# Altium schematic sheet NTC.SchDoc: NTC
size A3; Date: 13/11/2025; DrawnBy: Văn Quý Tuân; Revision: 1; SheetNumber: 6; SheetTotal: 10; Subsystem: HW-11/11/25; Size: A3
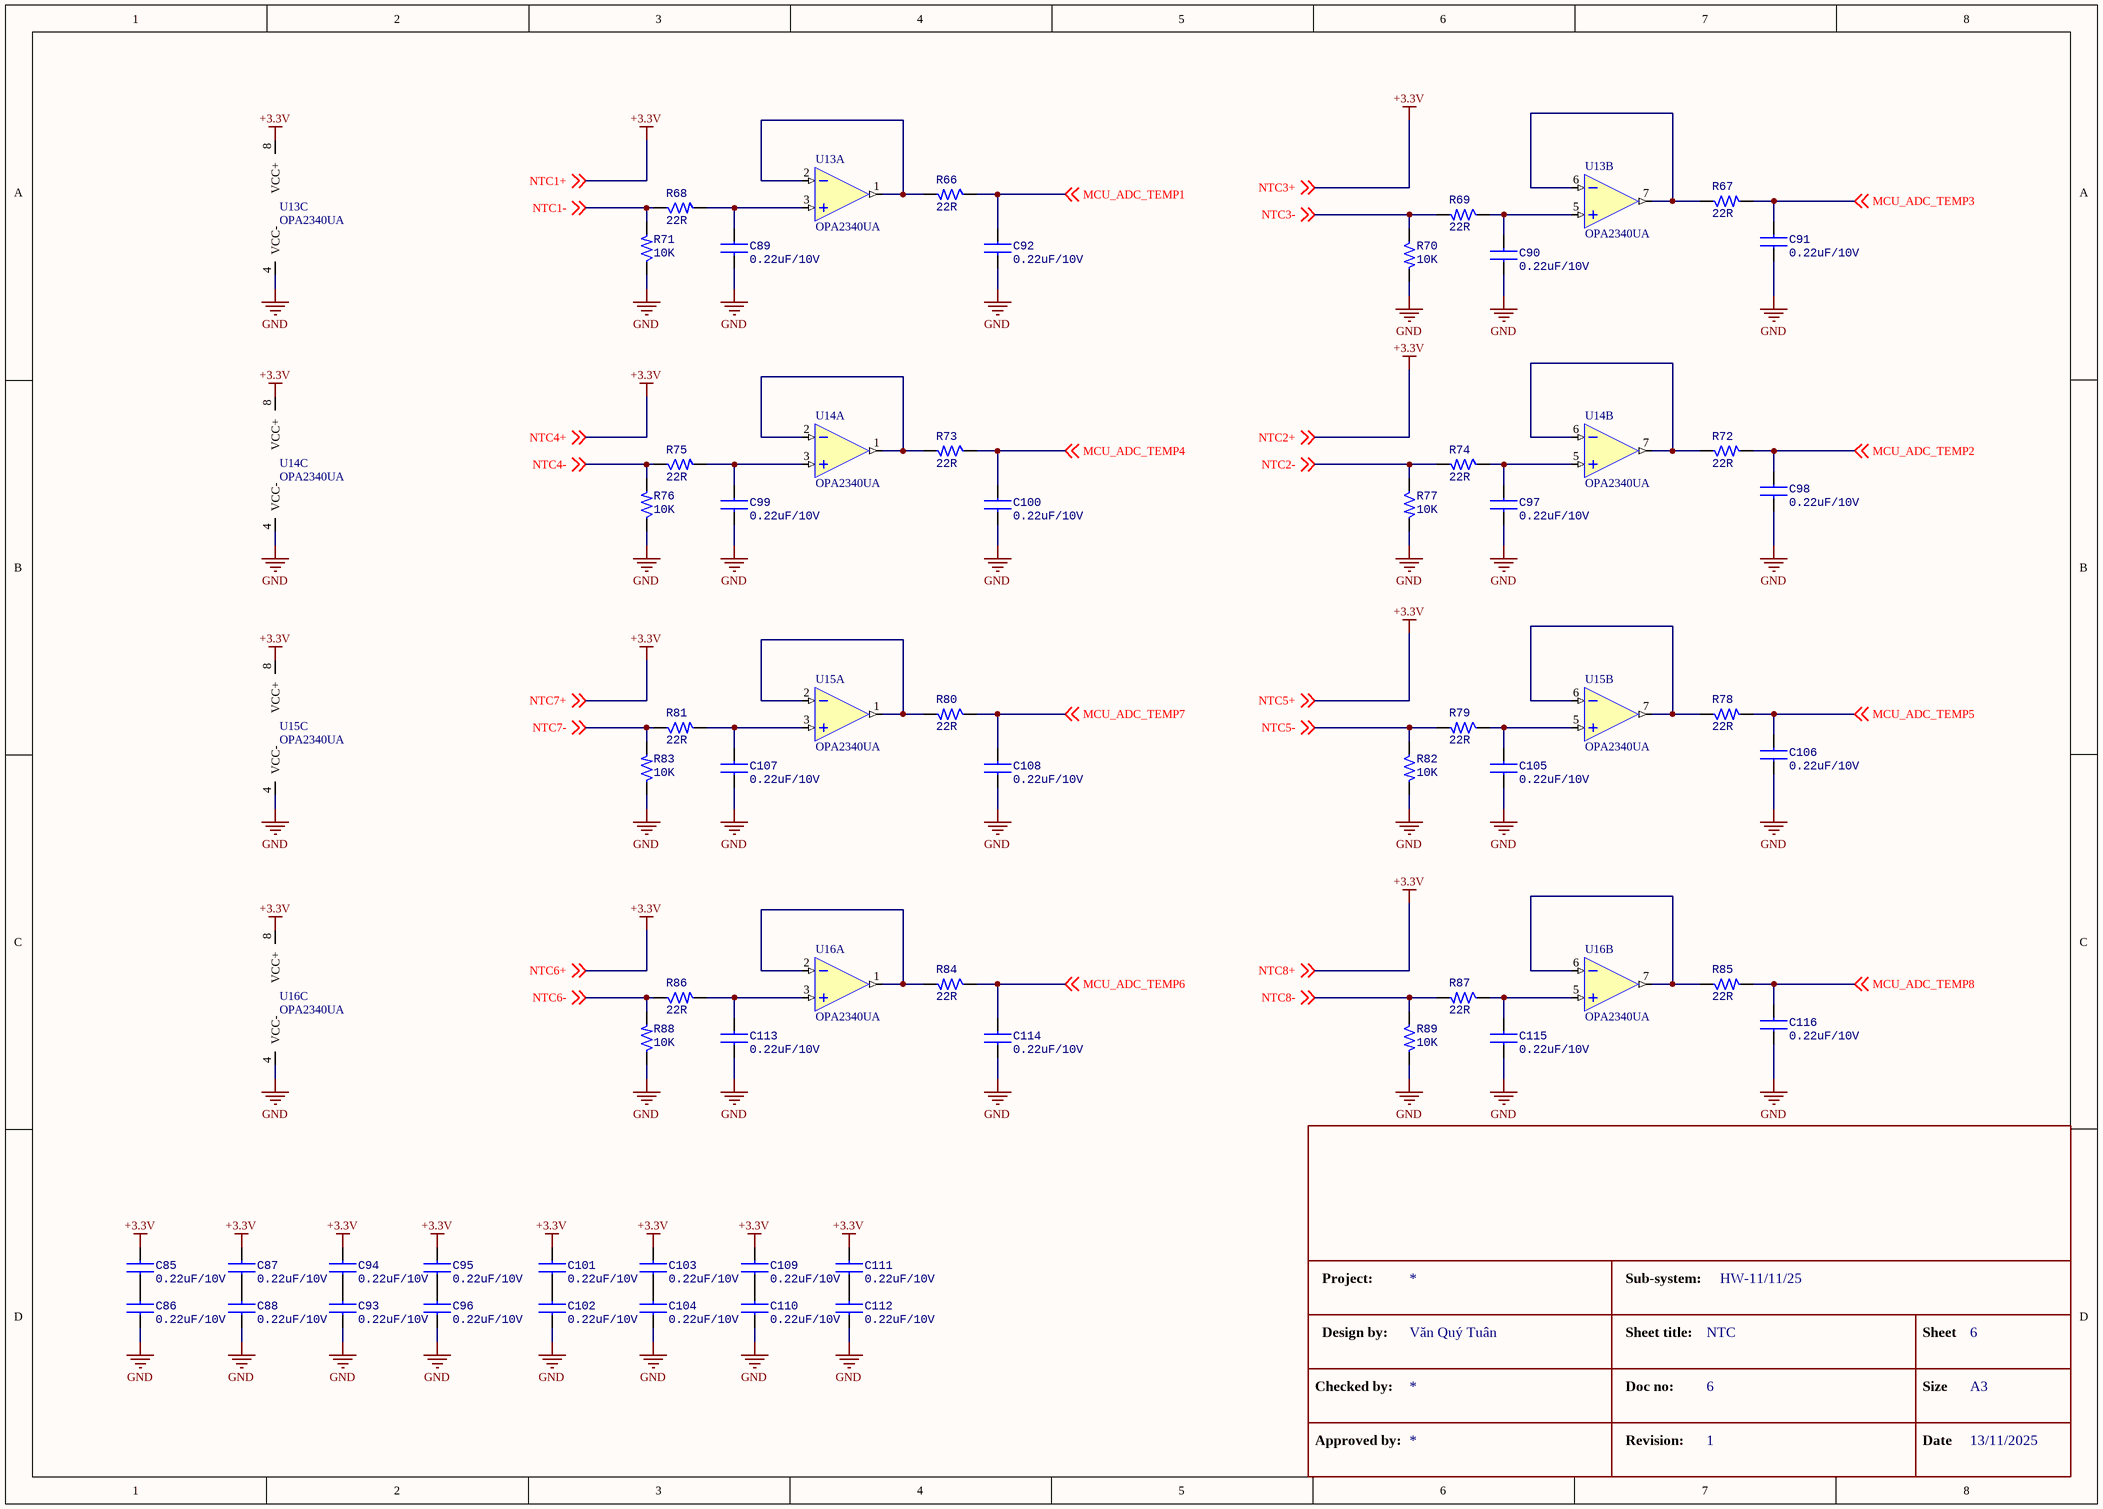
[diagram p0: NTC.SchDoc]

## Parts
C85  0.22uF/10V  [CAP-CER-0603]
C86  0.22uF/10V  [CAP-CER-0603]
C87  0.22uF/10V  [CAP-CER-0603]
C88  0.22uF/10V  [CAP-CER-0603]
C89  0.22uF/10V  [CAP-CER-0603]
C90  0.22uF/10V  [CAP-CER-0603]
C91  0.22uF/10V  [CAP-CER-0603]
C92  0.22uF/10V  [CAP-CER-0603]
C93  0.22uF/10V  [CAP-CER-0603]
C94  0.22uF/10V  [CAP-CER-0603]
C95  0.22uF/10V  [CAP-CER-0603]
C96  0.22uF/10V  [CAP-CER-0603]
C97  0.22uF/10V  [CAP-CER-0603]
C98  0.22uF/10V  [CAP-CER-0603]
C99  0.22uF/10V  [CAP-CER-0603]
C100  0.22uF/10V  [CAP-CER-0603]
C101  0.22uF/10V  [CAP-CER-0603]
C102  0.22uF/10V  [CAP-CER-0603]
C103  0.22uF/10V  [CAP-CER-0603]
C104  0.22uF/10V  [CAP-CER-0603]
C105  0.22uF/10V  [CAP-CER-0603]
C106  0.22uF/10V  [CAP-CER-0603]
C107  0.22uF/10V  [CAP-CER-0603]
C108  0.22uF/10V  [CAP-CER-0603]
C109  0.22uF/10V  [CAP-CER-0603]
C110  0.22uF/10V  [CAP-CER-0603]
C111  0.22uF/10V  [CAP-CER-0603]
C112  0.22uF/10V  [CAP-CER-0603]
C113  0.22uF/10V  [CAP-CER-0603]
C114  0.22uF/10V  [CAP-CER-0603]
C115  0.22uF/10V  [CAP-CER-0603]
C116  0.22uF/10V  [CAP-CER-0603]
R66  22R  [RES-SMD-0603]
R67  22R  [RES-SMD-0603]
R68  22R  [RES-SMD-0603]
R69  22R  [RES-SMD-0603]
R70  10K  [RES-SMD-0603]
R71  10K  [RES-SMD-0603]
R72  22R  [RES-SMD-0603]
R73  22R  [RES-SMD-0603]
R74  22R  [RES-SMD-0603]
R75  22R  [RES-SMD-0603]
R76  10K  [RES-SMD-0603]
R77  10K  [RES-SMD-0603]
R78  22R  [RES-SMD-0603]
R79  22R  [RES-SMD-0603]
R80  22R  [RES-SMD-0603]
R81  22R  [RES-SMD-0603]
R82  10K  [RES-SMD-0603]
R83  10K  [RES-SMD-0603]
R84  22R  [RES-SMD-0603]
R85  22R  [RES-SMD-0603]
R86  22R  [RES-SMD-0603]
R87  22R  [RES-SMD-0603]
R88  10K  [RES-SMD-0603]
R89  10K  [RES-SMD-0603]
U13  OPA2340UA  [SOIC-8]  (parts A,B,C of 3)
U14  OPA2340UA  [SOIC-8]  (parts A,B,C of 3)
U15  OPA2340UA  [SOIC-8]  (parts A,B,C of 3)
U16  OPA2340UA  [SOIC-8]  (parts A,B,C of 3)

## Nets
+3.3V: C85.1 C87.1 C94.1 C95.1 C101.1 C103.1 C109.1 C111.1 U13.8(VCC+) U14.8(VCC+) U15.8(VCC+) U16.8(VCC+) ; off-sheet NTC1+, off-sheet NTC3+, off-sheet NTC4+, off-sheet NTC2+, off-sheet NTC7+, off-sheet NTC5+, off-sheet NTC6+, off-sheet NTC8+  [also labelled NTC1+, NTC2+, NTC3+, NTC4+, NTC5+, NTC6+, NTC7+, NTC8+]
GND: C86.2 C88.2 C89.2 C90.2 C91.2 C92.2 C93.2 C96.2 C97.2 C98.2 C99.2 C100.2 C102.2 C104.2 C105.2 C106.2 C107.2 C108.2 C110.2 C112.2 C113.2 C114.2 C115.2 C116.2 R70.2 R71.1 R76.1 R77.2 R82.2 R83.1 R88.1 R89.2 U13.4(VCC-) U14.4(VCC-) U15.4(VCC-) U16.4(VCC-)
MCU_ADC_TEMP1: C92.1 R66.1 ; off-sheet MCU_ADC_TEMP1
MCU_ADC_TEMP2: C98.1 R72.2 ; off-sheet MCU_ADC_TEMP2
MCU_ADC_TEMP3: C91.1 R67.2 ; off-sheet MCU_ADC_TEMP3
MCU_ADC_TEMP4: C100.1 R73.1 ; off-sheet MCU_ADC_TEMP4
MCU_ADC_TEMP5: C106.1 R78.2 ; off-sheet MCU_ADC_TEMP5
MCU_ADC_TEMP6: C114.1 R84.1 ; off-sheet MCU_ADC_TEMP6
MCU_ADC_TEMP7: C108.1 R80.1 ; off-sheet MCU_ADC_TEMP7
MCU_ADC_TEMP8: C116.1 R85.2 ; off-sheet MCU_ADC_TEMP8
NTC1-: R68.1 R71.2 ; off-sheet NTC1-
NTC2-: R74.2 R77.1 ; off-sheet NTC2-
NTC3-: R69.2 R70.1 ; off-sheet NTC3-
NTC4-: R75.1 R76.2 ; off-sheet NTC4-
NTC5-: R79.2 R82.1 ; off-sheet NTC5-
NTC6-: R86.1 R88.2 ; off-sheet NTC6-
NTC7-: R81.1 R83.2 ; off-sheet NTC7-
NTC8-: R87.2 R89.1 ; off-sheet NTC8-
NetC85_2: C85.2 C86.1
NetC87_2: C87.2 C88.1
NetC89_1: C89.1 R68.2 U13.3(1IN+)
NetC90_1: C90.1 R69.1 U13.5(2IN+)
NetC93_1: C93.1 C94.2
NetC95_2: C95.2 C96.1
NetC97_1: C97.1 R74.1 U14.5(2IN+)
NetC99_1: C99.1 R75.2 U14.3(1IN+)
NetC101_2: C101.2 C102.1
NetC103_2: C103.2 C104.1
NetC105_1: C105.1 R79.1 U15.5(2IN+)
NetC107_1: C107.1 R81.2 U15.3(1IN+)
NetC109_2: C109.2 C110.1
NetC111_2: C111.2 C112.1
NetC113_1: C113.1 R86.2 U16.3(1IN+)
NetC115_1: C115.1 R87.1 U16.5(2IN+)
NetR66_2: R66.2 U13.1(1OUT) U13.2(1IN-)
NetR67_1: R67.1 U13.6(2IN-) U13.7(2OUT)
NetR72_1: R72.1 U14.6(2IN-) U14.7(2OUT)
NetR73_2: R73.2 U14.1(1OUT) U14.2(1IN-)
NetR78_1: R78.1 U15.6(2IN-) U15.7(2OUT)
NetR80_2: R80.2 U15.1(1OUT) U15.2(1IN-)
NetR84_2: R84.2 U16.1(1OUT) U16.2(1IN-)
NetR85_1: R85.1 U16.6(2IN-) U16.7(2OUT)

## Notes on the sheet
- Project:
- Sub-system:
- Checked by:
- Design by:
- Sheet title:
- Doc no:
- Sheet
- Size
- Approved by:
- Revision:
- Date
- Text

## Library data of the parts
C85-C116 = CAP-CER
R66-R89 = RES-SMD
U13-U16 = TL072CDT: Dual JFET Low-Noise Operational Amplifiers; Manufacturer: STMicroelectronics; Manufacturer Part Number: TL072CDT